# Altium schematic sheet phase.SchDoc
size A3; SheetNumber: 2; SheetTotal: 3
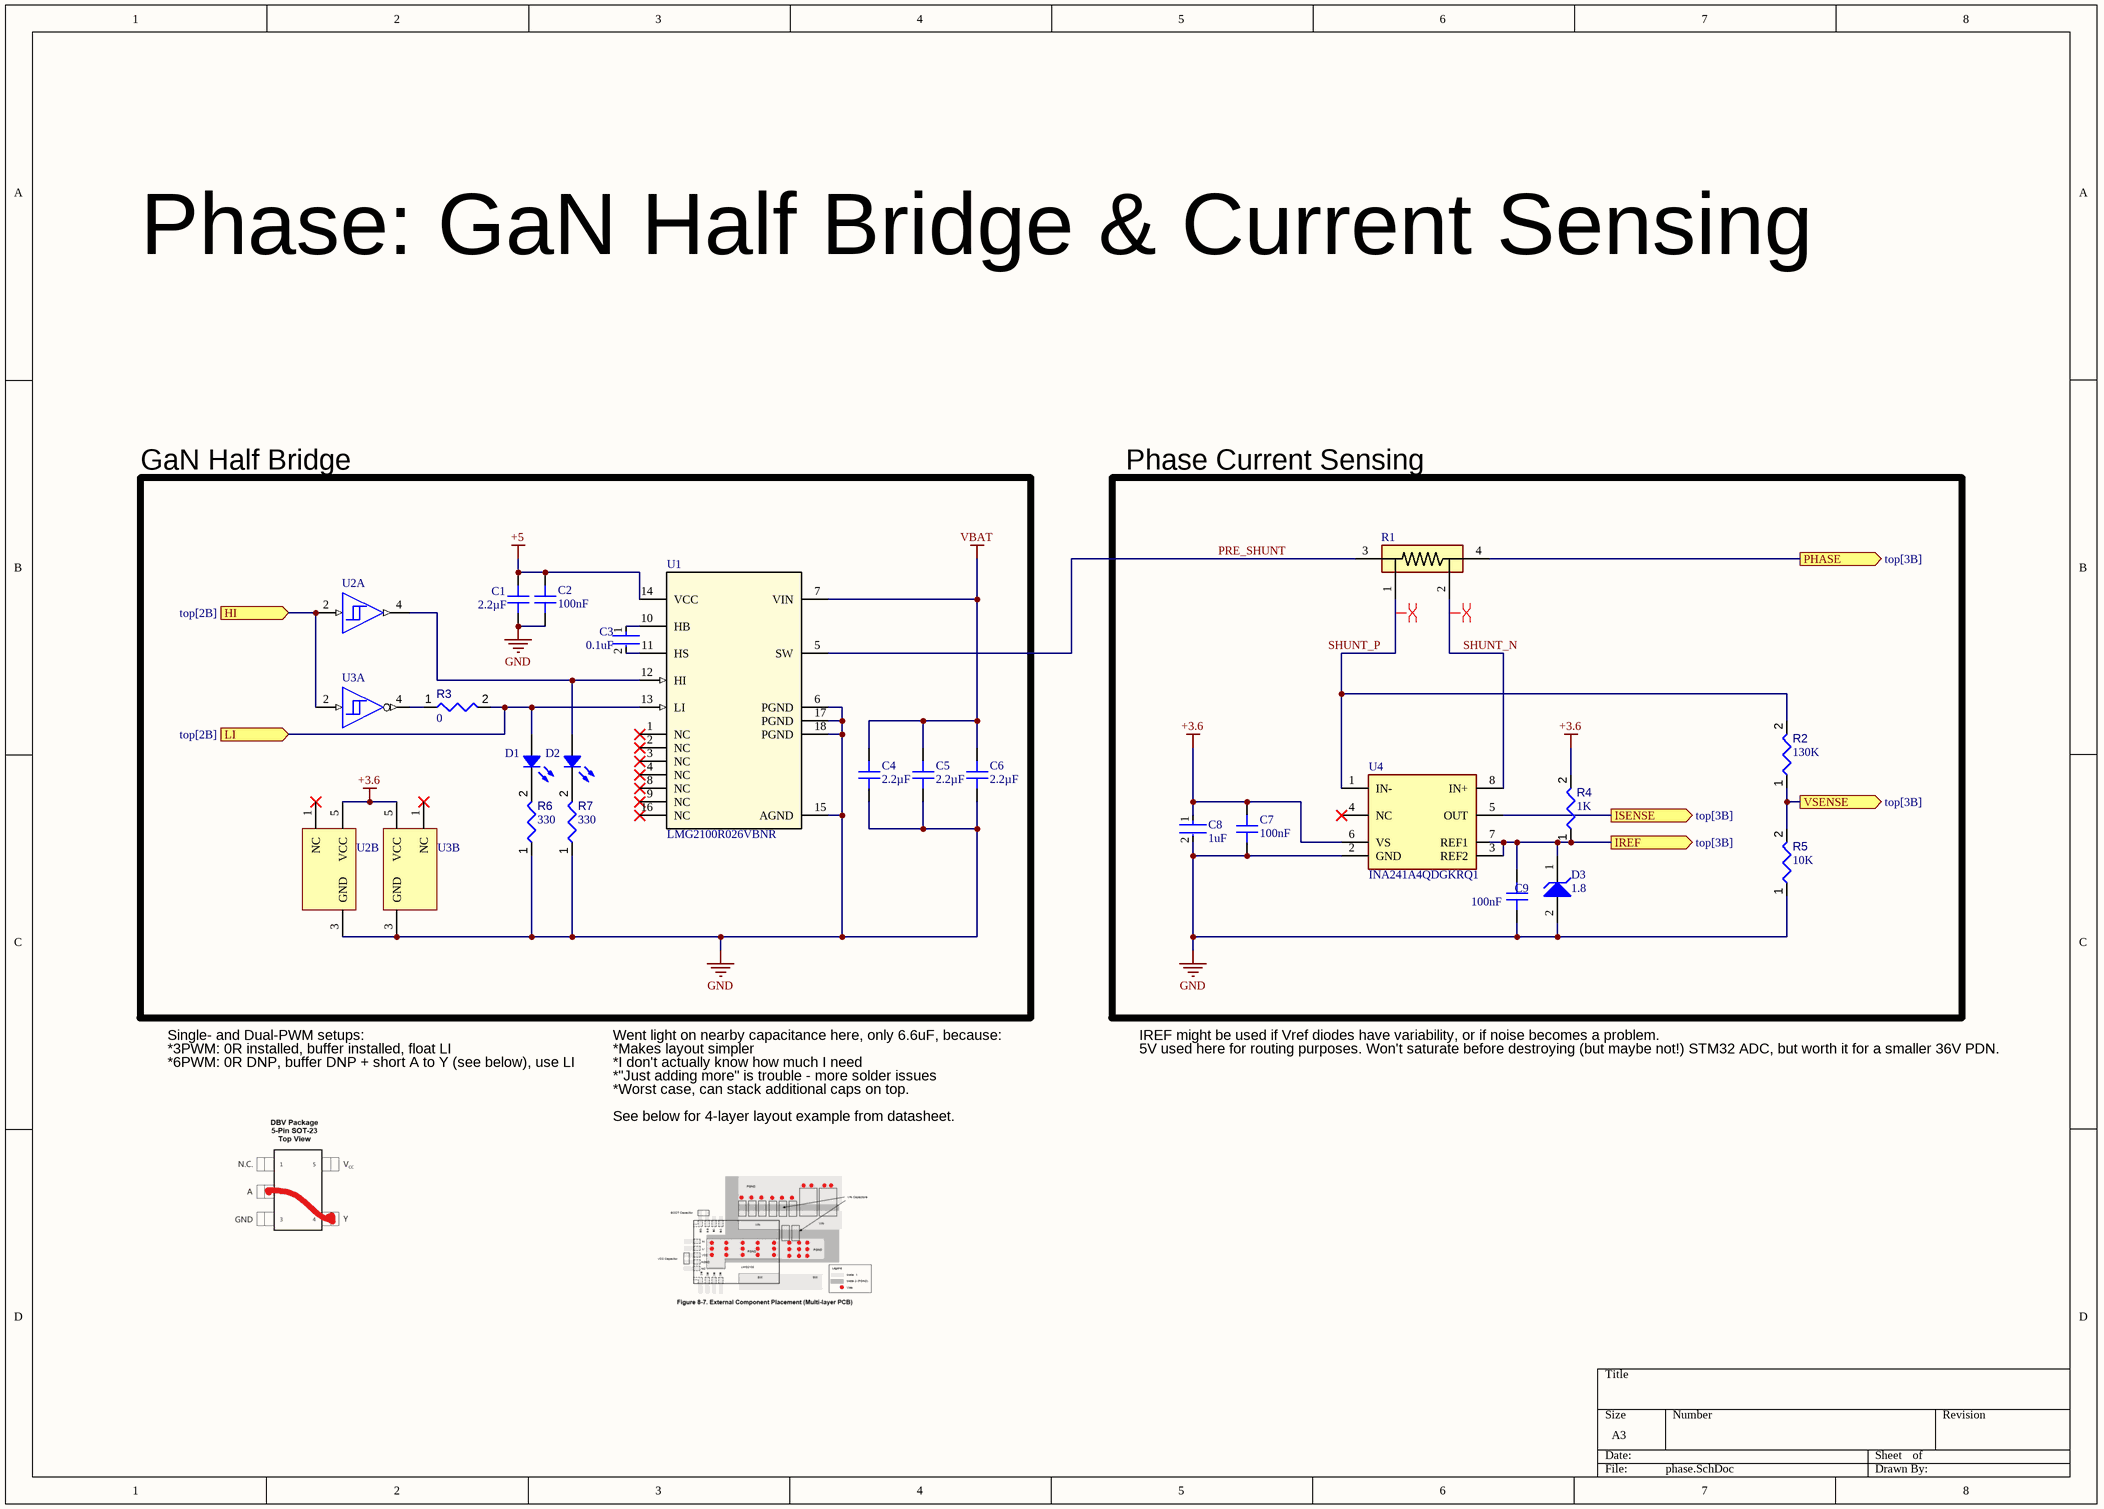
[diagram p0: phase.SchDoc]

## Parts
C1  value 2.2µF  [CAP 0603_1608]  (hidden comment: KGM15BR51C225KM)
C2  value 100nF  [CAPC0402(1005)33_L]  (hidden comment: CL05B104KO5NNNC)
C3  0.1uF  [FP-GRM155-0_05-MFG]
C4  value 2.2µF  [MURATA GRM21B 0805_2012]  (hidden comment: GRM21BD72A225ME01K)
C5  value 2.2µF  [MURATA GRM21B 0805_2012]  (hidden comment: GRM21BD72A225ME01K)
C6  value 2.2µF  [MURATA GRM21B 0805_2012]  (hidden comment: GRM21BD72A225ME01K)
C7  value 100nF  [CAPC0402(1005)33_L]  (hidden comment: CL05B104KO5NNNC)
C8  1uF  [FP-GRM155-0_05-MFG]
C9  value 100nF  [CAPC0402(1005)33_L]  (hidden comment: CL05B104KO5NNNC)
D1  150060BS55040  [LED 0603_1608 BLUE]  (value not drawn)
D2  150060BS55040  [LED 0603_1608 BLUE]  (value not drawn)
D3  VZ Typ (V): 1.8  [ONSC-SOD-123-2-425-04_V]  (hidden comment: SZMMSZ4678T1G)
R1  PU2726FKMPD0U3L  [PU2726FKMPD0U3L]  (value not drawn)
R2  value 130K  [RESC0603(1608)_L]  (hidden comment: 120R3J)
R3  value 0  [RESC0603(1608)_L]  (hidden comment: 0R3J)
R4  value 1K  [RESC0603(1608)_L]  (hidden comment: 120R3J)
R5  value 10K  [RESC0603(1608)_L]  (hidden comment: 120R3J)
R6  value 330  [RESC0603(1608)_L]  (hidden comment: 120R3J)
R7  value 330  [RESC0603(1608)_L]  (hidden comment: 120R3J)
U1  LMG2100R026VBNR  [VBN0018A-MFG]
U2  SN74AUP1G17DBVT  [DBV0005A_N]  (value not drawn)  (parts A,B of 2)
U3  SN74LVC1G14MDBVREP  [DBV0005A_N]  (value not drawn)  (parts A,B of 2)
U4  INA241A4QDGKRQ1  [SOIC127P600X175-8N]

## Blocks framed on the sheet
GaN Half Bridge: C1-C6 D1 D2 R3 R6 R7 U1-U3
Phase Current Sensing: C7-C9 D3 R1 R2 R4 R5 U4

## Ports
HI (in, see top[2B]), IREF (out, see top[3B]), ISENSE (out, see top[3B]), LI (in, see top[2B]), PHASE (out, see top[3B]), VSENSE (out, see top[3B])

## Nets
+3.6: C7.2 C8.1 R4.2 U2.5(VCC) U3.5(VCC) U4.6(VS)
+5: C1.2 C2.2 U1.14(VCC)
GND: C1.1 C2.1 C4.1 C5.1 C6.1 C7.1 C8.2 C9.1 D3.2(A) R5.1 R6.1 R7.1 U1.6(PGND) U1.15(AGND) U1.17(PGND) U1.18(PGND) U2.3(GND) U3.3(GND) U4.2(GND)
VBAT: C4.2 C5.2 C6.2 U1.7(VIN)
HI: U2.2(A) U3.2(A) ; port HI
IREF: C9.2 D3.1(K) R4.1 U4.3(REF2) U4.7(REF1) ; port IREF
ISENSE: U4.5(OUT) ; port ISENSE
LI: D1.1 R3.2 U1.13(LI) ; port LI
PHASE: R1.4 ; port PHASE
PRE_SHUNT: R1.3 U1.5(SW)
SHUNT_N: R1.2 U4.8(IN+)
SHUNT_P: R1.1 R2.2 U4.1(IN-)
VSENSE: R2.1 R5.2 ; port VSENSE
NetC3_1: C3.1 U1.10(HB)
NetC3_2: C3.2 U1.11(HS)
NetD1_2: D1.2 R6.2
NetD2_1: D2.1 U1.12(HI) U2.4(Y)
NetD2_2: D2.2 R7.2
NetR3_1: R3.1 U3.4(Y)

Not connected (* = marked no-connect by the designer): U1 1(NC)* 2(NC)* 3(NC)* 4(NC)* 8(NC)* 9(NC)* 16(NC)*; U2 1(NC)*; U3 1(NC)*; U4 4(NC)*

## Layout directives
differential pair: SHUNT_N, SHUNT_P

## Notes on the sheet
- Phase: GaN Half Bridge & Current Sensing
- Single- and Dual-PWM setups:
- *3PWM: 0R installed, buffer installed, float LI
- Went light on nearby capacitance here, only 6.6uF, because:
- *Makes layout simpler
- IREF might be used if Vref diodes have variability, or if noise becomes a problem.
- 5V used here for routing purposes. Won't saturate before destroying (but maybe not!) STM32 ADC, but worth it for a smaller 36V PDN.
- *6PWM: 0R DNP, buffer DNP + short A to Y (see below), use LI
- *I don't actually know how much I need
- *"Just adding more" is trouble - more solder issues
- *Worst case, can stack additional caps on top.
- See below for 4-layer layout example from datasheet.

## Library data of the parts
C1 = CMP-001-48803-2: CAP CER 2.2UF 16V X5R 0603; manufacturer: KYOCERA AVX; Tolerance: 10%; Part Number: KGM15BR51C225KM; series: KGM - X5R; lastupdated: 2/9/2024 8:09:11 PM; Size / Dimension: 0.063" L x 0.031" W (1.60mm x 0.80mm); ComponentLink2Description: DigiKey Link; Operating Temperature: -55°C ~ 85°C; ComponentLink1URL: https://datasheets.kyocera-avx.com/cx5r.pdf; Mounting Type: Surface Mount, MLCC; Part Status: Active; ComponentLink1Description: Datasheet; partid: 53097; Lifecycle Status: Active; price: 0.04; Device Package: 0603 (1608 Metric); Thickness (Max): 0.037" (0.95mm); Case/Package: 0603 (1608 Metric); packaging: TapeAndReel; Applications: General Purpose; ComponentLink2URL: https://www.digikey.com/en/products/detail/kyocera-avx/KGM15BR51C225KM/9749268; Temperature Coefficient: X5R; Voltage - Rated: 16V; Minimum Order: 1
C2 C7 C9 = CMP-001-35390-2: CAP CER 0.1UF 16V X7R 0402; manufacturer: Samsung Electro-Mechanics; Tolerance: 10%; ComponentLink2URL: https://www.digikey.com/en/products/detail/samsung-electro-mechanics/CL05B104KO5NNNC/3886659; Lifecycle Status: Active; lastupdated: 2/9/2024 8:04:31 PM; price: 0.01; Case/Package: 0402 (1005 Metric); series: CL; Mounting Type: Surface Mount, MLCC; ComponentLink1URL: http://www.samsungsem.com/kr/support/product-search/mlcc/CL05B104KO5NNNC.jsp; ComponentLink2Description: DigiKey Link; Part Status: Active; Part Number: CL05B104KO5NNNC; Thickness (Max): 0.022" (0.55mm); packaging: CutTape; Temperature Coefficient: X7R; Applications: General Purpose; Voltage - Rated: 16V; Device Package: 0402 (1005 Metric); Size / Dimension: 0.039" L x 0.020" W (1.00mm x 0.50mm); ComponentLink1Description: Datasheet; Operating Temperature: -55°C ~ 125°C; Minimum Order: 1; partid: 6066
C3 C8 = CMP-06035-012136-1: Chip Multilayer Ceramic Capacitors for General Purpose, 0402, 1.0uF, B, 10%, 20%, 16V
C4-C6 = CMP-001-56417-1: CAP CER 2.2UF 100V X7T 0805; manufacturer: Murata Electronics; Tolerance: 20%; Size / Dimension: 0.079" L x 0.049" W (2.00mm x 1.25mm); Lifecycle Status: Active; Voltage - Rated: 100V; ComponentLink1Description: Datasheet; Operating Temperature: -55°C ~ 125°C; partid: 45172; Applications: General Purpose; Thickness (Max): 0.057" (1.45mm); Temperature Coefficient: X7T; Part Number: GRM21BD72A225ME01K; price: 0.08; ComponentLink2URL: https://www.digikey.com/en/products/detail/murata-electronics/GRM21BD72A225ME01K/15972575; Mounting Type: Surface Mount, MLCC; packaging: TapeAndReel; lastupdated: 8/27/2024 9:29:54 AM; Case/Package: 0805 (2012 Metric); Minimum Order: 1; series: GRM; ComponentLink1URL: https://search.murata.co.jp/Ceramy/image/img/A01X/G101/ENG/GRM21BD72A225ME01-01A.pdf; Part Status: Active; ComponentLink2Description: DigiKey Link; Device Package: 0805 (2012 Metric)
D1 D2 = CMP-004-14535-2: LED BLUE DIFFUSED 0603 SMD; Manufacturer: Würth Elektronik; Current - Test: 20mA; Voltage - Forward (Vf) (Typ): 3.2V; Configuration: Standard; Lens Color: 0.50mm; Lens Style: Rectangle with Flat Top; Millicandela Rating: 80mcd; Lens Size: 1.00mm x 0.80mm; Viewing Angle: 140°; Wavelength - Peak: 465nm; Wavelength - Dominant: 470nm; LastUpdated: 6/3/2024 7:57:52 PM; Part Number: 150060BS55040; Color: Blue; Device Package: 0603 (1608 Metric); Lifecycle Status: Active; PartId: 796; Size / Dimension: 1.60mm L x 0.80mm W; Part Status: Active; ComponentLink1Description: Datasheet; Value: Blue; ComponentLink2URL: https://www.digikey.com/en/products/detail/würth-elektronik/150060BS55040/8557178; Height (Max): 0.50mm; ComponentLink1URL: https://www.we-online.de/web/en/index.php/download/media/07_electronic_components/download_center_1/application_notes_berichte/ano002_leds___the_future_of_horticultural_lighting/ANO002b_EN_LEDs_The_Future_of_Horticultural_Lighting.pdf; Series: WL-SMCD; Lens Transparency: Diffused; Case/Package: 0603 (1608 Metric); Mounting Type: Surface Mount; Packaging: TapeAndReel; Supplier Device Package: 0603 (1608 Metric); Price: 0.11; Minimum Order: 1; ComponentLink2Description: DigiKey Link
D3 = CMP-1060-00510-1: Zener Voltage Regulator, 500 mW, 2-Pin SOD-123, Pb-Free, Tape and Reel; Manufacturer: On Semiconductor; P Max (W): 0.5; PartNumber: SZMMSZ4678T1G; PackageDescription: 2-Pin SOD, Body 1.6 x 2.69 mm; Mounting Technology: Surface Mount; ComponentLink2URL: http://www.onsemi.com/pub_link/Collateral/MMSZ4678T1-D.PDF; ComponentLink1URL: http://www.onsemi.com/; DatasheetVersion: Rev. 9; PackageVersion: Rev. G, 10/2009; ComponentLink3Description: Package Specification; ComponentLink2Description: Datasheet; Packing: Tape and Reel; ComponentLink3URL: http://www.onsemi.com/pub_link/Collateral/425-04.PDF; RoHS: Pb-Free; PackageReference: SOD-123-2-425-04; ComponentLink1Description: Manufacturer URL
R1 = CMP-1021-000000-2: Thick Film Resistors - SMD 0.3mOhms 11W 2726 1% 75ppm Shunt AEC-Q200; Manufacturer_Name: Yageo Group; Geometry.Height: 3.7mm; Mouser Part Number: *; Datasheet Link: https://www.yageogroup.com/content/datasheet/asset/file/PYU-PU2726_ROHS_L; Arrow Price/Stock: *; Mouser Price/Stock: *; Manufacturer_Part_Number: PU2726FKMPD0U3L; Arrow Part Number: *; Source: PU2726FKMPD0U3L.SchLib; Design Item ID: PU2726FKMPD0U3L
R2 R4-R7 = CMP-009-00069-2: 120R 0.1W 5% 0603 (1608 Metric)  SMD; Power: 100mW; Mounting Technology: SMT; Tolerance: 5%; Case/Package: 0603; Pins: 2
R3 = CMP-009-00063-2: Jumper 0603 (1608 Metric); Case/Package: 0603; Mounting Technology: SMT; Pins: 2
U1 = CMP-1018-000000-3: 100V 2.6mOhm GaN half bridge module; Manufacturer_Name: Texas Instruments; TYPE: TYPE; Copyright: Copyright (C) 2025 Ultra Librarian. All rights reserved.; Manufacturer_Part_Number: LMG2100R026VBNR; Component Type: Standard; Design Item ID: LMG2100R026VBNR; Pin Count: 18; RefDes: RefDes; Source: LMG2100R026VBNR.SchLib
U2 = CMP-0859-00081-4: Low-Power Single Schmitt-Trigger Buffer, DBV0005A, SMALL T&R; Manufacturer: Texas Instruments; VCC(Max)(V): 3.6; Voltage(Nom)(V): 0.8,1.2,1.5,1.8,2.5,3.3; F @ Nom Voltage(Max)(Mhz): 100; Input Type: CMOS; VCC(Min)(V): 0.8; 3-State Output: No; Sub-Family: Non-Inverting Buffer/Driver; Rating: Catalog; Schmitt Trigger: Yes; Technology Family: AUP; tpd @ Nom Voltage(Max)(ns): 35.1,18.1,12.9,11,7.9,6.7; Logic: True; Bits(#): 1; Output Drive (IOL/IOH)(Max)(mA): 20/-20; ICC @ Nom Voltage(Max)(mA): 0.0009; DatasheetVersion: SCES579I; Generic Part Number: SN74AUP1G17; Operating Temperature Range(C): -40 to 85; Output Type: CMOS; PackageReference: DBV0005A
U3 = CMP-0859-00034-4: Enhanced Product Single Schmitt-Trigger Inverter, DBV0005A, LARGE T&R; Generic Part Number: SN74LVC1G14-EP; Manufacturer: Texas Instruments; tpd @ Nom Voltage(Max)(ns): 16,7.5,6,5; ICC @ Nom Voltage(Max)(mA): 0.019; Schmitt Trigger: Yes; Voltage(Nom)(V): 1.8,2.5,3.3,5; Sub-Family: Inverting Buffer/Driver; VCC(Max)(V): 5.5; Bits(#): 1; Logic: Inverting; 3-State Output: No; Rating: HiRel Enhanced Product; F @ Nom Voltage(Max)(Mhz): 150; VCC(Min)(V): 1.65; Input Type: CMOS/TTL; Technology Family: LVC; Output Drive (IOL/IOH)(Max)(mA): 32/-32; Output Type: CMOS; PackageReference: DBV0005A; DatasheetVersion: SCES674; Operating Temperature Range(C): -55 to 125
U4 = CMP-014-00010-2: Current Sense Amplifiers AEC-Q100, -4-V to 110-V bidirectional ultraprecise current sense amp with enhanced PWM rejection 8-VSSOP -40 to 125; Manufacturer_Name: Texas Instruments; Geometry.Height: 1.1mm; Mouser Price/Stock: https://www.mouser.co.uk/ProductDetail/Texas-Instruments/INA241A4QDGKRQ1?qs=HoCaDK9Nz5fDURPmL7Cdag%3D%3D; Mouser Part Number: 595-INA241A4QDGKRQ1; Datasheet Link: https://www.ti.com/lit/ds/symlink/ina241a-q1.pdf?ts=1710247494397&ref_url=https%253A%252F%252Fwww.ti.com%252Fproduct%252FINA241A-Q1%252Fpart-details%252FINA241A4QDGKRQ1; Source: INA241A4QDGKRQ1.SchLib; Design Item ID: INA241A4QDGKRQ1; Manufacturer_Part_Number: INA241A4QDGKRQ1